# EAGLE design Kodi Remote (EAGLE 7.2.0)
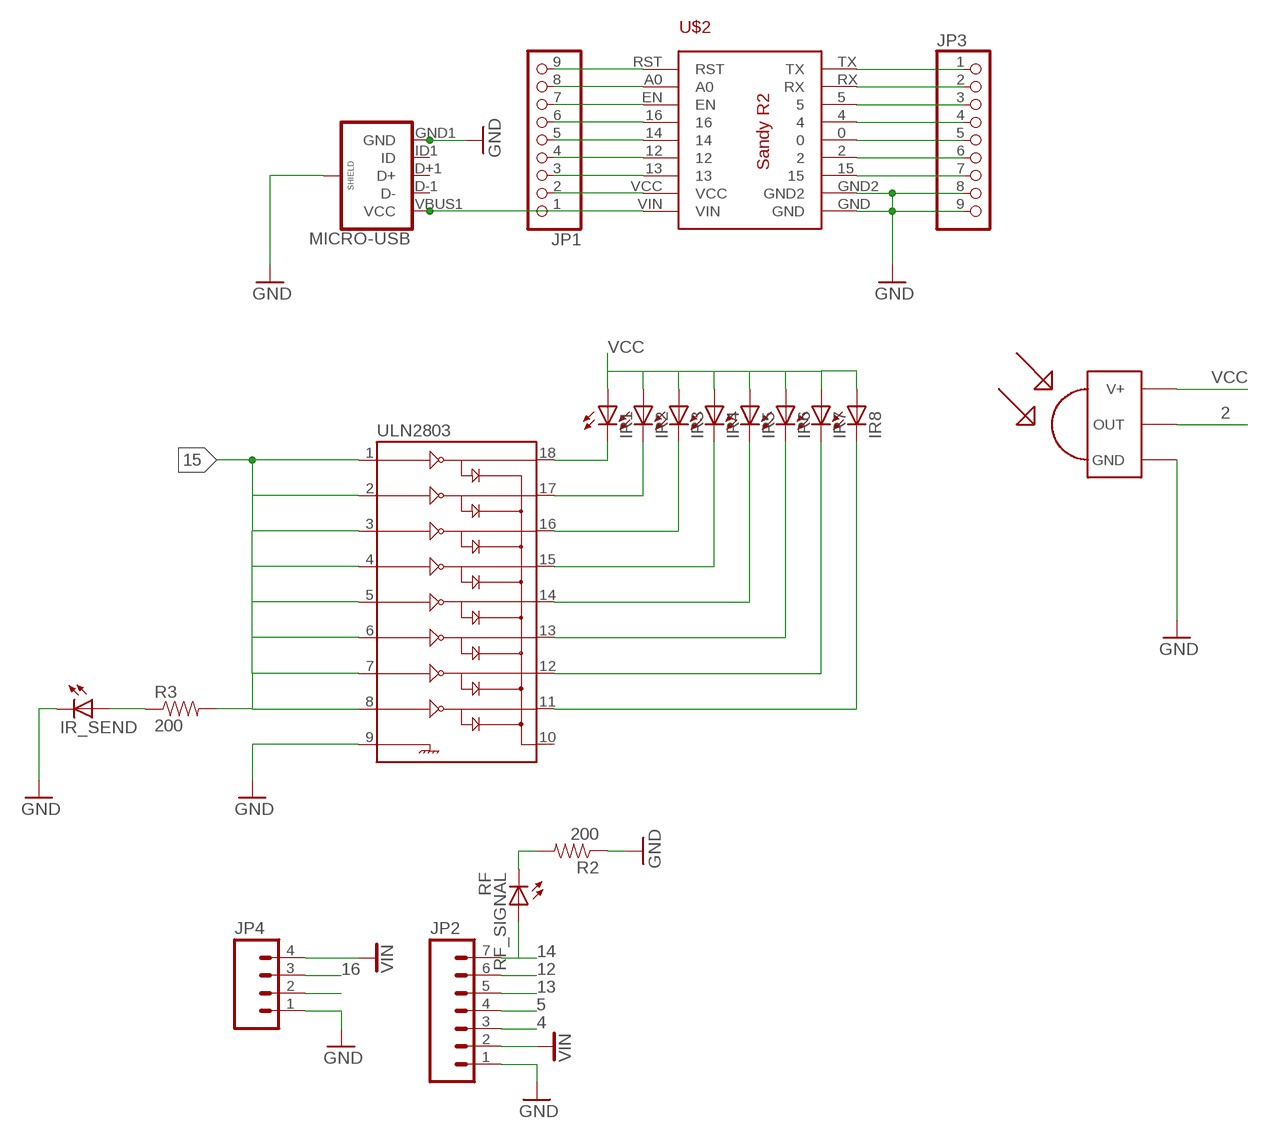
[diagram p0: schematic, sheet 1]

## Parts
IR1  LED5MM  [LED5MM]
IR2  LED5MM  [LED5MM]
IR3  LED5MM  [LED5MM]
IR4  LED5MM  [LED5MM]
IR5  LED5MM  [LED5MM]
IR6  LED5MM  [LED5MM]
IR7  LED5MM  [LED5MM]
IR8  LED5MM  [LED5MM]
IR_SEND  LED3MM  [LED3MM]
JP1  PINHD-1X9  [1X09-BIG]
JP2  M07  [1X07]
JP3  PINHD-1X9  [1X09-BIG]
JP4  M04PTH  [1X04]
MICRO-USB  USB_MICROB_PLUGCONN-11752  [USB-B-MICRO-SMD_V03]
R2  200  RESISTOR0805-RES  [0805]
R3  200  RESISTOR0805-RES  [0805]
RF_SIGNAL  RF  LED3MM  [LED3MM]
TSOP1838  TSOP1838  [TSOP18XX]
U$2  MINI-ESPMINI-ESP-LOCK  [MINI-ESP-LOCK]
ULN2803  ULN2803DIP  [DIL18]

## Nets
0: JP3.5 U$2.0
2: JP3.6 TSOP1838.OUT U$2.2
4: JP2.3 JP3.4 U$2.4
5: JP2.4 JP3.3 U$2.5
12: JP1.4 JP2.6 U$2.12
13: JP1.3 JP2.5 U$2.13
14: JP1.5 JP2.7 RF_SIGNAL.A U$2.14
15: JP3.7 R3.2 U$2.15 ULN2803.1 ULN2803.2 ULN2803.3 ULN2803.4 ULN2803.5 ULN2803.6 ULN2803.7 ULN2803.8
16: JP1.6 JP4.3 U$2.16
A0: JP1.8 U$2.A0
EN: JP1.7 U$2.EN
GND: IR_SEND.K(C) JP2.1 JP3.8 JP3.9 JP4.1 MICRO-USB.GND1(GND) MICRO-USB.SHIELD1(SHIELD) MICRO-USB.SHIELD2(SHIELD) MICRO-USB.SHIELD3(SHIELD) R2.1 TSOP1838.GND U$2.GND U$2.GND2 ULN2803.9
IR4: IR4.K(C) ULN2803.15
N$1: R2.2 RF_SIGNAL.K(C)
N$4: IR_SEND.A R3.1
N$9: IR1.K(C) ULN2803.18
N$10: JP4.2
N$11: IR2.K(C) ULN2803.17
N$12: IR3.K(C) ULN2803.16
N$14: IR5.K(C) ULN2803.14
N$15: IR6.K(C) ULN2803.13
N$16: IR7.K(C) ULN2803.12
N$17: IR8.K(C) ULN2803.11
RST: JP1.9 U$2.RST
RX: JP3.2 U$2.RX
TX: JP3.1 U$2.TX
VCC: IR1.A IR2.A IR3.A IR4.A IR5.A IR6.A IR7.A IR8.A JP1.2 TSOP1838.VCC(V+) U$2.VCC
VIN: JP1.1 JP2.2 JP4.4 MICRO-USB.VBUS1(VCC) U$2.VIN
Unconnected: MICRO-USB.D+1(D+) MICRO-USB.D-1(D-) MICRO-USB.ID1(ID) ULN2803.10

## Library data of the parts
IR1-IR8 IR_SEND RF_SIGNAL = adafruit:LED: LED OSRAM: - CHIPLED LG R971, LG N971, LY N971, LG Q971, LY Q971, LO R971, LY R971 LH N974, LH R974 LS Q976, LO Q976, LY Q976 LO Q996 - Hyper CHIPLED LW Q18S LB Q993, LB Q99A, LB R99A - SideLED LS A670, LO A670, LY A670, LG A670, LP A670 LB A673, LV A673, LT A673, LW A673 LH A674 LY A675 LS A676, LA A676, LO A676, LY A676, LW A676 LS A679, LY A679, LG A679 - Hyper Micro SIDELED® LS Y876, LA Y876, LO Y876, LY Y876 LT Y87S - SmartLED LW L88C, LW L88S LB L89C, LB L89S, LG L890 LS L89K, LO L89K, LY L89K LS L896, LA L896, LO L896, LY L896 - TOPLED LS T670, LO T670, LY T670, LG T670, LP T670 LSG T670, LSP T670, LSY T670, LOP T670, LYG T670 LG T671, LOG T671, LSG T671 LB T673, LV T673, LT T673, LW T673 LH T674 LS T676, LA T676, LO T676, LY T676, LB T676, LH T676, LSB T676, LW T676 LB T67C, LV T67C, LT T67C, LS T67K, LO T67K, LY T67K, LW E67C LS E67B, LA E67B, LO E67B, LY E67B, LB E67C, LV E67C, LT E67C LW T67C LS T679, LY T679, LG T679 LS T770, LO T770, LY T770, LG T770, LP T770 LB T773, LV T773, LT T773, LW T773 LH T774 LS E675, LA E675, LY E675, LS T675 LS T776, LA T776, LO T776, LY T776, LB T776 LHGB T686 LT T68C, LB T68C - Hyper Mini TOPLED® LB M676 - Mini TOPLED Santana® LG M470 LS M47K, LO M47K, LY M47K Source: http://www.osram.convergy.de/
JP1 JP3 = adafruit:PINHD-1X9: Pin header 1x10 0.1" spacing With round pins
JP2 = SparkFun-Connectors:M07: Header 7 Standard 7-pin 0.1" header. Use with straight break away headers (SKU : PRT-00116), right angle break away headers (PRT-00553), swiss pins (PRT-00743), machine pins (PRT-00117), and female headers (PRT-00115). NOTES ON THE VARIANTS LOCK and LOCK_LONGPADS... This footprint was designed to help hold the alignment of a through-hole component (i.e. 7-pin header) while soldering it into place. You may notice that each hole has been shifted either up or down by 0.005 of an inch from it's more standard position (which is usually a perfectly straight line). This slight alteration caused the pins (the squares in the middle) to touch the edges of the holes. Because they are alternating, it causes a "brace" to hold the header in place. 0.005 has proven to be the perfect amount of "off-center" position when using our standard breakaway headers. Although looks a little odd when you look at the bare footprint, once you have a header in there, the alteration is very hard to notice. Also, if you push a header all the way into place, it is covered up entirely on the bottom side. This idea of altering the position of holes to aid alignment will be further integrated into the Sparkfun Library for other footprints. It can help hold any component with 3 or more connection pins.
JP4 = SparkFun-Connectors:M04: Header 4 Standard 4-pin 0.1" header. Use with straight break away headers (SKU : PRT-00116), right angle break away headers (PRT-00553), swiss pins (PRT-00743), machine pins (PRT-00117), and female headers (PRT-00115). Molex polarized connector foot print use with SKU : PRT-08231 with associated crimp pins and housings. 1MM SMD Version SKU: PRT-10208
MICRO-USB = SparkFun-Connectors:USB_MICROB_PLUG: USB Micro-B connectors Some male, some female. Watch your step!; PROD_ID: CONN-11752
R2 R3 = SparkFun-Resistors:RESISTOR: Resistor Basic schematic elements and footprints for 0603, 1206, and PTH resistors.
TSOP1838 = tsop:TSOP1838: IR Receiver and Demodulator
U$2 = My Eagle Lib:MINI-ESP
ULN2803 = SparkFun-PowerIC:ULN2803: Darlington Driver ULN2803 Darlington array. 500mA max per channel, 8-channel package. Spark Fun Electronics SKU : COM-00312

## Board
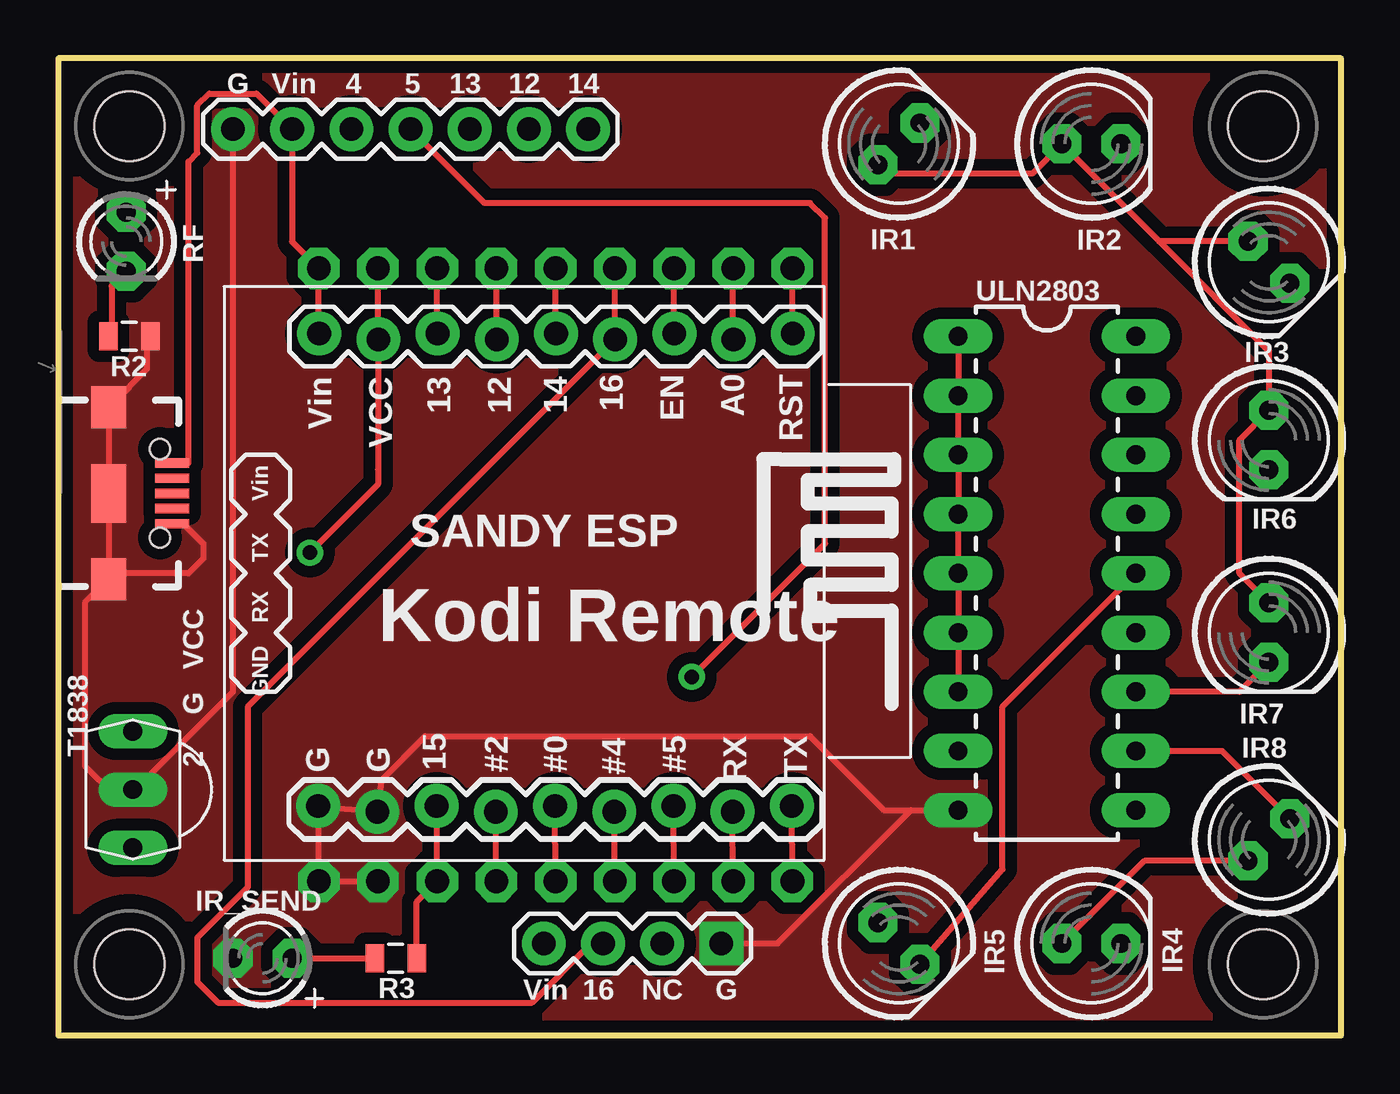
[diagram p1: board, top side]
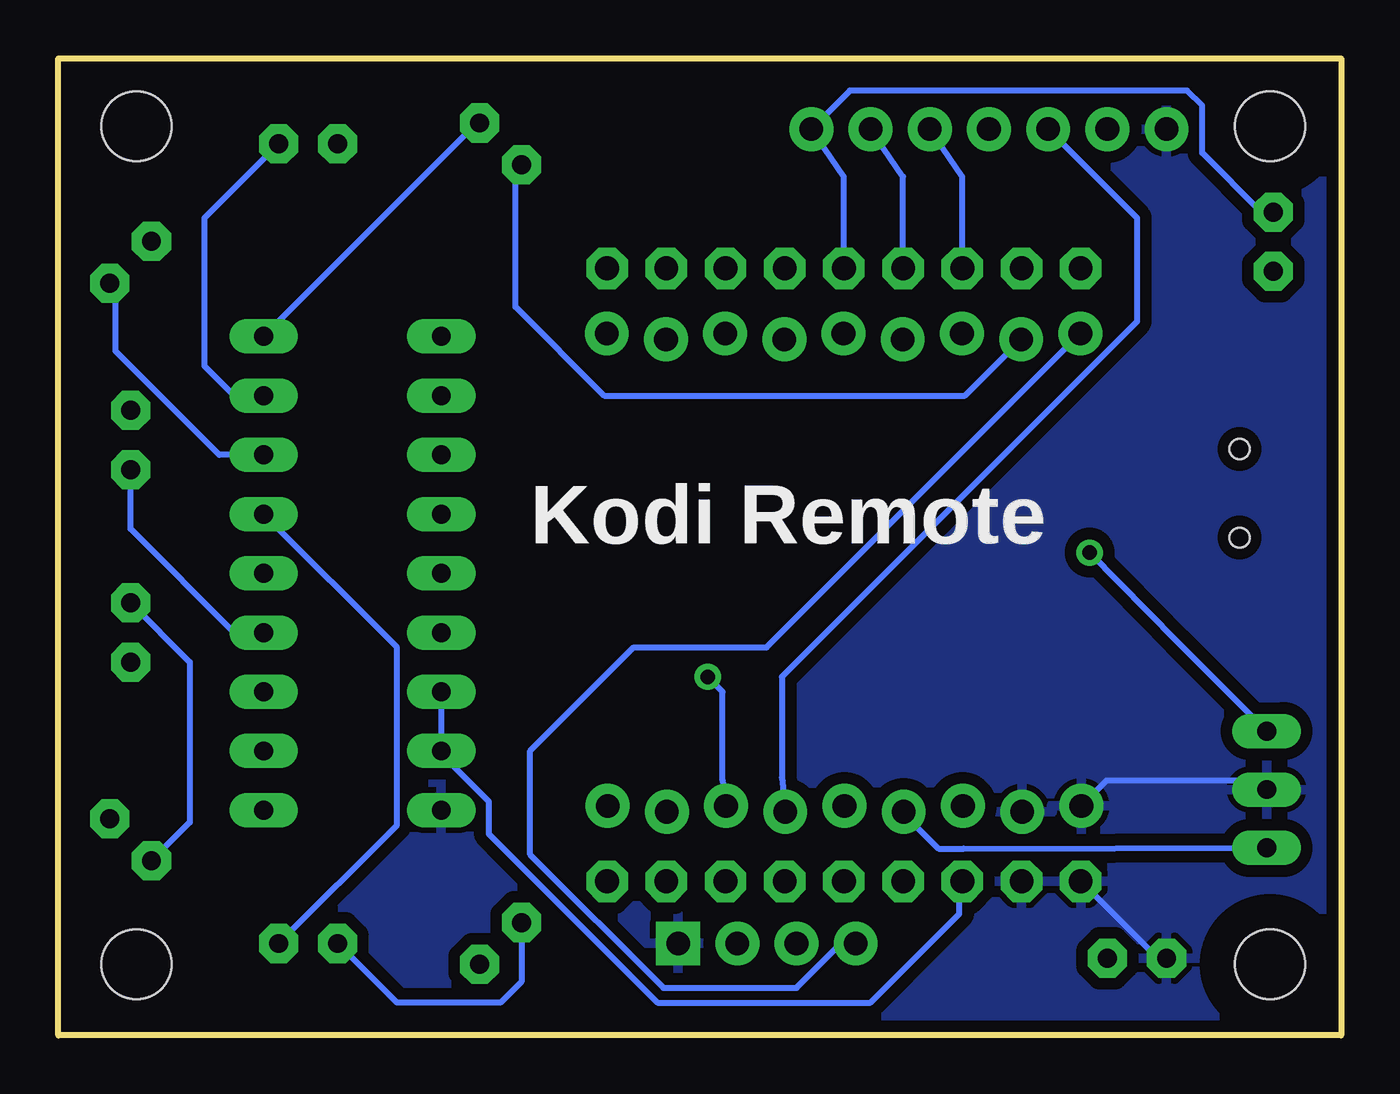
[diagram p2: board, bottom side, seen from below]

Size 55.04 x 41.9 mm. Coordinates in mm from the lower left corner, seen from the top.
Outline: 0,0 55.04,0 55.04,41.9 0,41.9 0,0
Copper layers (1*16): Top 0.035mm / dielectric 1.5mm / Bottom 0.035mm
Design rules "default *": minimum track width 10mil, minimum drill 24mil, track to track 10mil, track to pad 10mil, pad to pad 10mil, via to via 10mil, smd to smd 8mil, copper to edge 20mil, drill to drill 12mil, minimum pad ring 13mil, minimum via ring 10mil, stop-mask expansion 4mil, vias tented up to drill 0mil, thermal gap 10mil

### Footprints (pad centres in the part's own frame; a part is rotated, then mirrored left to right if it is on the bottom)
LED5MM = drill 0.813 pad 1.676 octagon: A -1.27,0; K 1.27,0
LED3MM = drill 0.813 pad 1.676 octagon: A -1.27,0; K 1.27,0
1X09-BIG = drill 1.016 pad 1.778 octagon: 1 -10.16,0; 2 -7.62,0; 3 -5.08,0; 4 -2.54,0; 5 0,0; 6 2.54,0; 7 5.08,0; 8 7.62,0; 9 10.16,0
1X07 = drill 1.016 pad 1.88: 1 0,0; 2 2.54,0; 3 5.08,0; 4 7.62,0; 5 10.16,0; 6 12.7,0; 7 15.24,0
1X04 = drill 1.016 pad 1.88 square: 1 0,0 | drill 1.016 pad 1.88: 2 2.54,0; 3 5.08,0; 4 7.62,0
USB-B-MICRO-SMD_V03 = smd 1.45 x 0.4: D+1 2.725,0; D-1 2.725,0.65; GND1 2.725,-1.3; ID1 2.725,-0.65; VBUS1 2.725,1.3 | smd 1.5 x 1.8: SHIELD1 0,3.685; SHIELD2 0,-3.685 | smd 1.5 x 2.5: SHIELD3 0,0 | hole 0.85: 2.2,1.9; 2.2,-1.9
0805 = smd 0.8 x 1.2: 1 -0.9,0; 2 0.9,0
TSOP18XX = drill 0.813 long: GND -0.001,-0.027; OUT -2.501,-0.027; VCC 2.499,-0.027
MINI-ESP-LOCK = drill 1.016 pad 1.88: 0 9.973,1.5; 2 10.227,-1.04; 4 10.227,4.04; 5 9.973,6.58; 12 -10.033,-1; 13 -10.287,-3.54; 14 -10.287,1.54; 15 9.973,-3.58; 16 -10.033,4.08; A0 -10.033,9.16; EN -10.287,6.62; GND 9.973,-8.66; GND2 10.227,-6.12; RST -10.287,11.7; RX 10.227,9.12; TX 9.973,11.66; VCC -10.033,-6.08; VIN -10.287,-8.62
KFH-M3 = hole 3: 0,0
DIL18 = drill 0.813 long: 1 -10.16,-3.81; 2 -7.62,-3.81; 3 -5.08,-3.81; 4 -2.54,-3.81; 5 0,-3.81; 6 2.54,-3.81; 7 5.08,-3.81; 8 7.62,-3.81; 9 10.16,-3.81; 10 10.16,3.81; 11 7.62,3.81; 12 5.08,3.81; 13 2.54,3.81; 14 0,3.81; 15 -2.54,3.81; 16 -5.08,3.81; 17 -7.62,3.81; 18 -10.16,3.81

### Placement (x,y rotation side)
IR1  36.07,38.23 45 top
IR2  44.32,38.23 0 top
IR3  51.94,33.15 315 top
IR4  44.32,3.94 0 top
IR5  36.07,3.94 315 top
IR6  51.94,25.53 270 top
IR7  51.94,17.27 270 top
IR8  51.94,8.38 45 top
IR_SEND  8.76,3.3 180 top
JP1  21.34,32.89 0 top
JP2  7.49,38.86 0 top
JP3  21.34,6.6 180 top
JP4  28.45,3.94 180 top
MICRO-USB  2.16,23.24 0 top
R2  3.05,29.97 180 top
R3  14.48,3.3 0 top
RF_SIGNAL  2.92,34.04 270 top
TSOP1838  3.18,10.54 90 top
U$2  19.81,19.81 270 top
U$6  [KFH-M3]  3.05,3.05 0 top
U$7  [KFH-M3]  51.69,3.05 0 top
U$8  [KFH-M3]  51.69,38.99 0 top
U$9  [KFH-M3]  3.05,38.99 0 top
ULN2803  42.42,19.81 270 top

### Tracks (layer width: path | path; a pad name or v marks a point on that pad's centre or on a via)
0
  Top 0.254: JP3.5 U$2.0
2
  Top 0.254: JP3.6 U$2.2
  Bottom 0.254: U$2.2 18.8,9.53 17.27,8 16.19,8 TSOP1838.OUT
4
  Top 0.254: JP3.4 U$2.4
  Bottom 0.254: U$2.4 24,11.05 24,15.37 8.76,30.61 8.76,35.05 JP2.3
5  (via drill 0.61)
  Top 0.254: JP3.3 U$2.5 | v27.18,15.37 32.89,21.08 32.89,35.05 32.26,35.69 18.29,35.69 JP2.4
  Bottom 0.254: U$2.5 26.54,10.92 26.54,14.73 v27.18,15.37
12
  Top 0.254: JP1.4 18.8,29.84 U$2.12
  Bottom 0.254: JP1.4 18.8,36.83 JP2.6
13
  Top 0.254: JP1.3 16.26,30.1 U$2.13
  Bottom 0.254: JP1.3 16.26,36.83 JP2.5
14
  Top 0.254: JP1.5 21.34,30.1 U$2.14
  Bottom 0.254: JP1.5 21.34,36.83 JP2.7 21.08,40.51 6.6,40.51 5.97,39.88 5.97,37.85 3.43,35.31 RF_SIGNAL.A
15
  Top 0.254: ULN2803.1 ULN2803.2 ULN2803.3 ULN2803.4 ULN2803.5 ULN2803.6 ULN2803.7 | U$2.15 16.26,9.82 JP3.7 15.38,5.73 R3.2
  Bottom 0.254: ULN2803.7 ULN2803.8 38.61,12.07 36.58,10.03 36.58,8.64 29.34,1.4 20.19,1.4 16.38,5.21 16.38,6.48 JP3.7
16
  Top 0.254: JP1.6 23.88,29.84 U$2.16 8.13,14.08 8.13,6.35 5.97,4.19 5.97,2.29 6.86,1.4 20.32,1.4 22.86,3.94 JP4.3
A0
  Top 0.254: JP1.8 28.96,29.84 U$2.A0
EN
  Top 0.254: JP1.7 26.42,30.1 U$2.EN
GND
  Top 0.254: 36.58,9.65 35.43,9.65 32.26,12.83 15.75,12.83 13.84,10.92 U$2.GND2 11.18,9.78 JP3.9 JP3.8 | 36.58,9.65 ULN2803.9 | JP4.1 30.86,3.94 36.58,9.65 | JP2.1 7.49,14.73 3.68,10.92 3.58,10.92 TSOP1838.GND 2.95,10.29 2.41,10.29 1.14,11.56 1.14,18.54 MICRO-USB.SHIELD2 | MICRO-USB.SHIELD2 MICRO-USB.SHIELD3 MICRO-USB.SHIELD1 2.29,27.05 3.81,28.58 3.81,29.84 R2.1 | MICRO-USB.GND1 5.36,21.94 6.22,21.08 6.22,20.45 5.59,19.81 2.41,19.81 MICRO-USB.SHIELD2
  Bottom 0.254: TSOP1838.GND 3.58,10.92 10.07,10.92 U$2.GND | IR_SEND.K 7.87,3.3 JP3.9
  pour Bottom (isolate 0.508): -4.57,45.21 62.99,45.09 62.99,-3.17 -4.57,-3.05
  pour Top (isolate 0.508, no thermals): -4.57,45.21 62.99,45.09 62.99,-3.17 -4.57,-3.05
IR4
  Bottom 0.254: IR4.K 40.51,9.02 40.51,16.64 ULN2803.15
N$1
  Top 0.254: RF_SIGNAL.K 2.29,32.13 2.29,30.1 R2.2
N$4
  Top 0.254: IR_SEND.A R3.1
N$9
  Bottom 0.254: IR1.K 37.08,39.12 ULN2803.18
N$11
  Bottom 0.254: ULN2803.17 47.5,27.43 48.77,28.7 48.77,35.05 IR2.K
N$12
  Bottom 0.254: ULN2803.16 48.13,24.89 52.58,29.34 52.58,31.99 IR3.K
N$14
  Top 0.254: ULN2803.14 40.51,14.1 40.51,7.11 IR5.K
N$15
  Bottom 0.254: ULN2803.13 47.5,17.27 51.94,21.72 IR6.K
N$16
  Top 0.254: ULN2803.12 50.67,14.73 IR7.K
N$17
  Top 0.254: ULN2803.11 49.93,12.19 IR8.K
RST
  Top 0.254: JP1.9 31.5,30.1 U$2.RST
RX
  Top 0.254: JP3.2 U$2.RX
TX
  Top 0.254: JP3.1 U$2.TX
VCC  (via drill 0.61)
  Top 0.254: JP1.2 13.72,29.84 U$2.VCC 13.72,24.26 13.72,23.62 v10.8,20.7 | 47.23,34.05 IR2.A 41.78,36.96 35.54,36.96 IR1.A | 47.23,34.05 51.94,29.34 IR6.A 50.67,25.53 50.67,19.81 IR7.A | IR4.A 46.6,7.48 IR8.A | IR3.A 47.23,34.05
  Bottom 0.254: IR1.A 35.43,37.07 35.43,31.24 31.62,27.43 16.14,27.43 U$2.VCC | IR7.A 49.4,16 49.4,9.13 IR8.A | IR5.A 35.17,2.3 36.07,1.4 40.51,1.4 IR4.A | v10.8,20.7 7.05,16.89 TSOP1838.VCC
VIN
  Top 0.254: U$2.VIN 11.18,30.1 JP1.1 10.03,34.04 JP2.2 8.51,40.39 6.48,40.39 5.97,39.88 5.97,37.85 5.59,37.47 5.59,24.54 MICRO-USB.VBUS1
  Bottom 0.254: JP4.4 21.46,3.94 23.37,2.03 29.08,2.03 34.8,7.75 34.8,12.19 30.35,16.64 24.65,16.64 U$2.VIN

### Text on the board
tNames: G | Vin | 4 | 5 | 13 | 12 | 14 | Kodi Remote | VCC | G | T1838 | 2 | Vin | 16 | NC | G
bNames: Kodi Remote